# Altium schematic sheet pump.SchDoc
size A
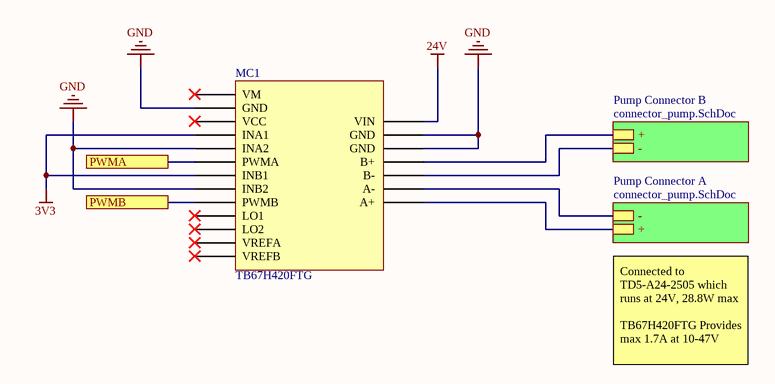
[diagram p0: pump.SchDoc]

## Parts
MC1  TB67H420FTG  [TB67H420FTG Dual/Single Motor Driver Carrier]

## Sub-sheets
Pump Connector A = connector_pump.SchDoc: +, -
Pump Connector B = connector_pump.SchDoc: +, -

## Ports
PWMA, PWMB

## Nets
3V3: MC1.4(INA1) MC1.7(INB1)
24V: MC1.20(VIN)
GND: MC1.2(GND) MC1.5(INA2) MC1.8(INB2) MC1.18(GND) MC1.19(GND)
PWMA: MC1.6(PWMA) ; port PWMA
PWMB: MC1.9(PWMB) ; port PWMB
NetMC1_14: MC1.14(A+) ; sheet Pump Connector A/+
NetMC1_15: MC1.15(A-) ; sheet Pump Connector A/-
NetMC1_16: MC1.16(B-) ; sheet Pump Connector B/-
NetMC1_17: MC1.17(B+) ; sheet Pump Connector B/+

Not connected (* = marked no-connect by the designer): MC1 1(VM)* 3(VCC)* 10(LO1)* 11(LO2)* 12(VREFA)* 13(VREFB)*

## Notes on the sheet
- Connected to TD5-A24-2505 which runs at 24V, 28.8W max
  TB67H420FTG Provides max 1.7A at 10-47V

## Library data of the parts
MC1 = TB67H420FTG Dual/Single Motor Driver Carrier